# EAGLE schematic amplifier-controller (EAGLE 7.6.0)
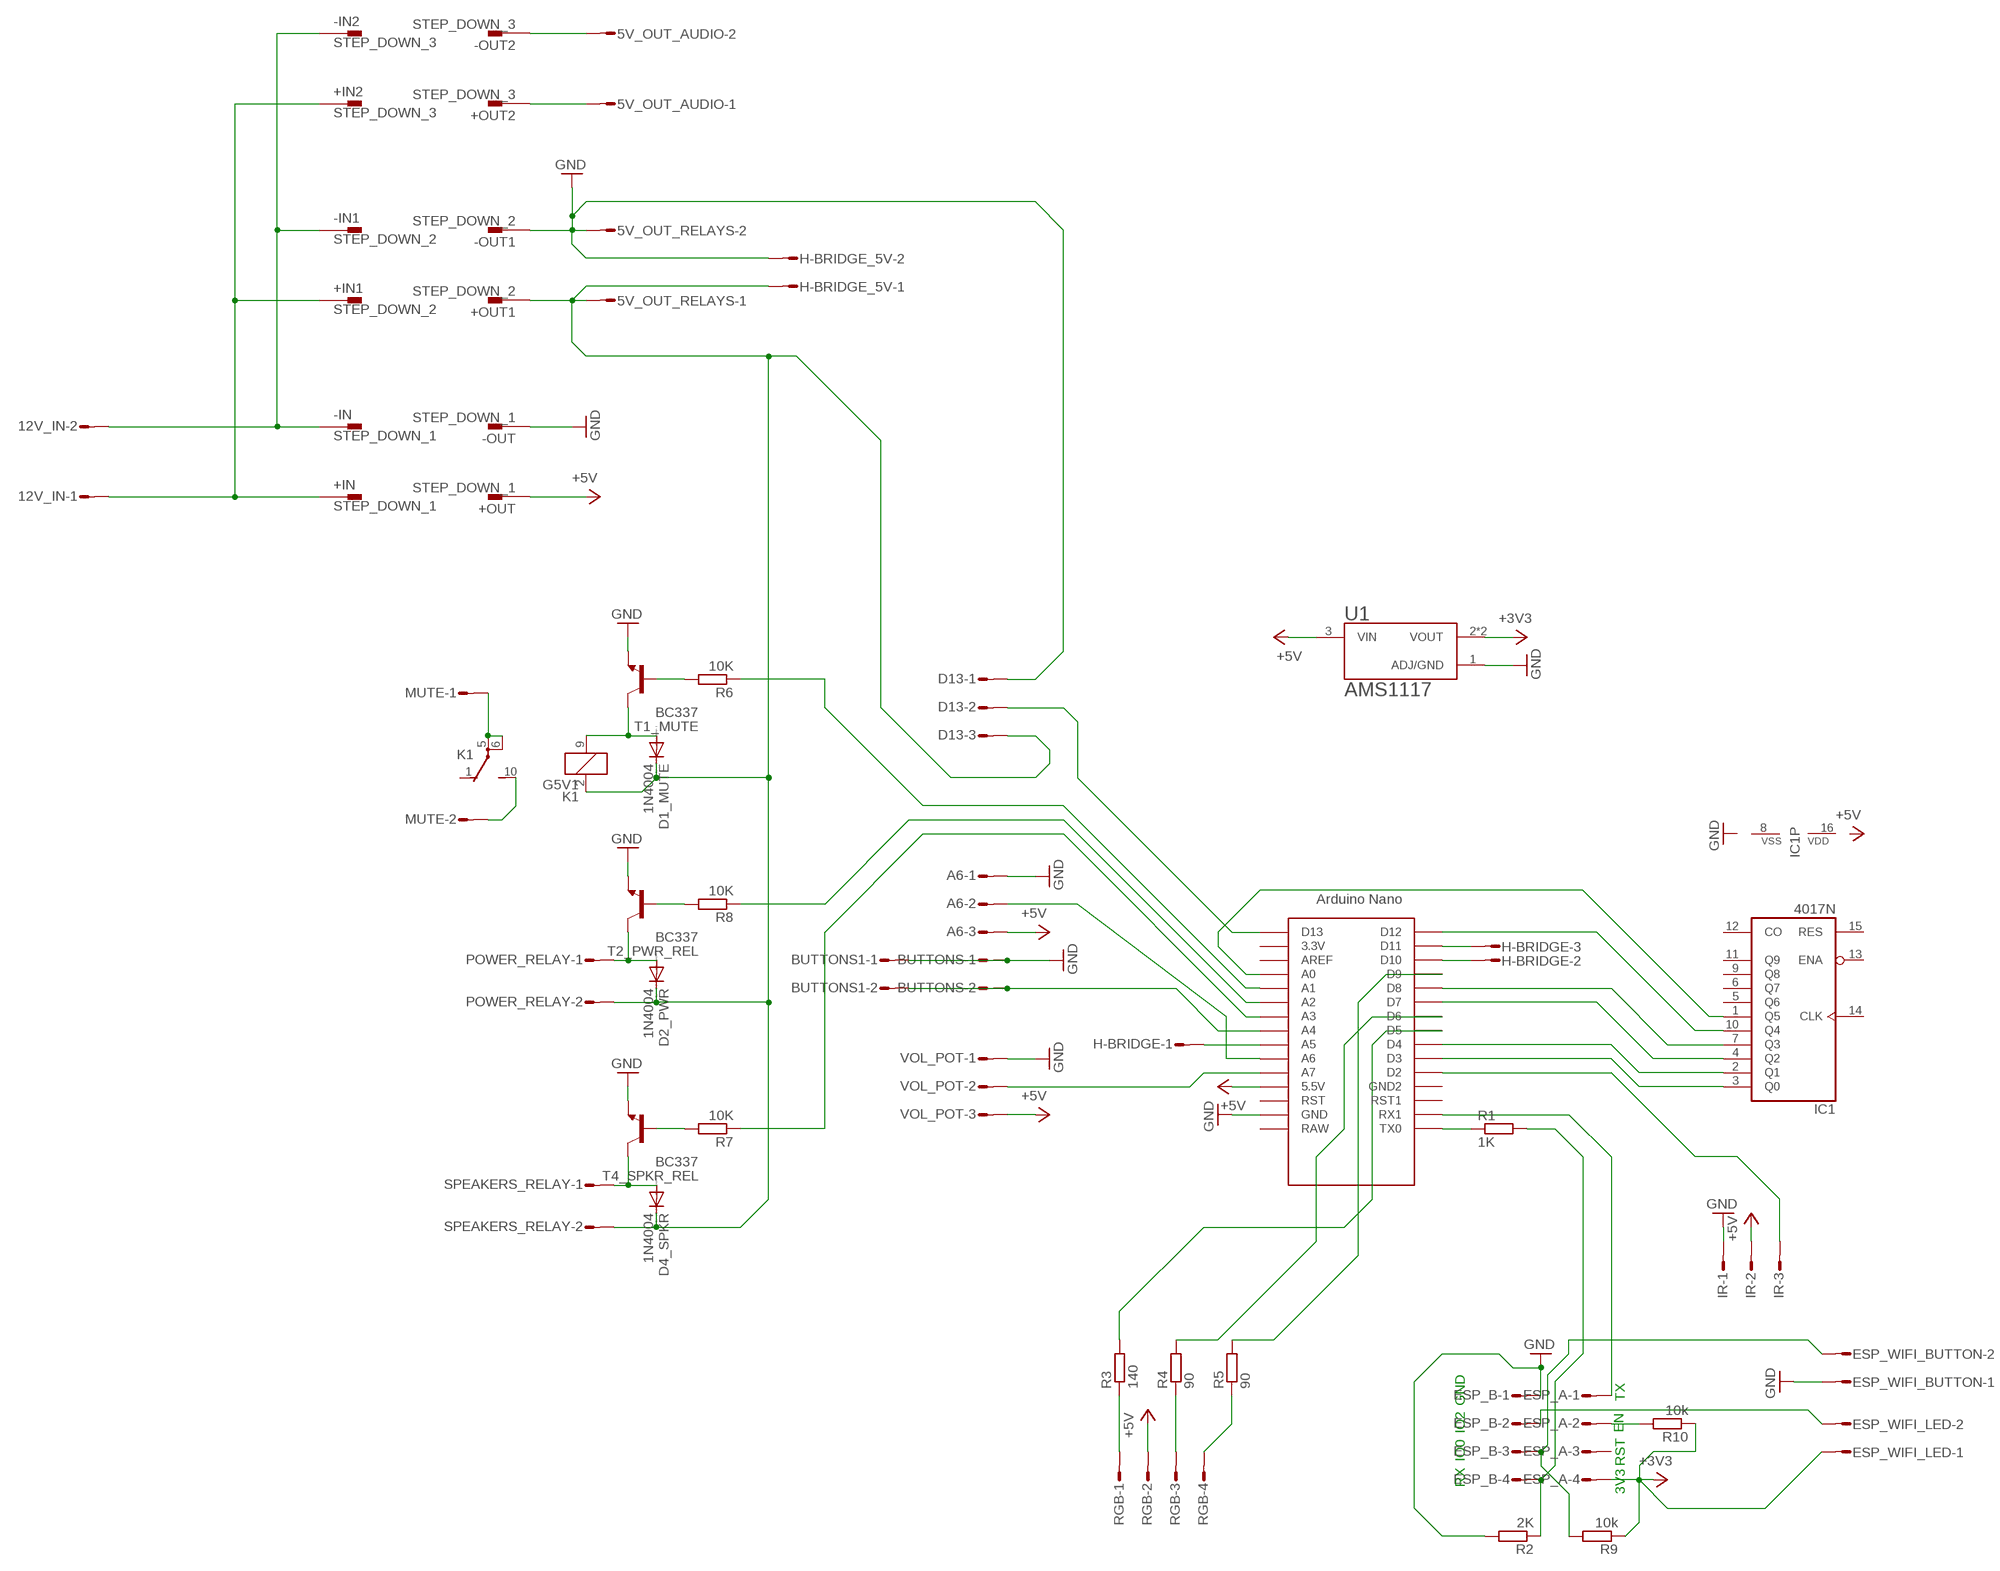
[diagram p0: schematic, sheet 1]

## Parts
5V_OUT_AUDIO  L02P  [L02P]
5V_OUT_RELAYS  L02P  [L02P]
12V_IN  L02P  [L02P]
+IN  STEP_DOWN_1  PIN1-2  [62221]
+IN1  STEP_DOWN_2  PIN1-2  [62221]
+IN2  STEP_DOWN_3  PIN1-2  [62221]
+OUT  STEP_DOWN_1  PIN1-2  [62221]
+OUT1  STEP_DOWN_2  PIN1-2  [62221]
+OUT2  STEP_DOWN_3  PIN1-2  [62221]
-IN  STEP_DOWN_1  PIN1-2  [62221]
-IN1  STEP_DOWN_2  PIN1-2  [62221]
-IN2  STEP_DOWN_3  PIN1-2  [62221]
-OUT  STEP_DOWN_1  PIN1-2  [62221]
-OUT1  STEP_DOWN_2  PIN1-2  [62221]
-OUT2  STEP_DOWN_3  PIN1-2  [62221]
A6  L03P  [L03P]
BUTTONS  L02P  [L02P]
BUTTONS1  L02P  [L02P]
D1_MUTE  1N4004  [DO41-10]
D2_PWR  1N4004  [DO41-10]
D4_SPKR  1N4004  [DO41-10]
D13  L03P  [L03P]
ESP_A  L04P  [L04P]
ESP_B  L04P  [L04P]
ESP_WIFI_BUTTON  L02P  [L02P]
ESP_WIFI_LED  L02P  [L02P]
H-BRIDGE  L03P  [L03P]
H-BRIDGE_5V  L02P  [L02P]
IC1  4017N  [DIL16]
IR  L03P  [L03P]
K1  G5V1  [G5V1]
MUTE  L02P  [L02P]
POWER_RELAY  L02P  [L02P]
R1  1K  R-EU_0411/15  [0411/15]
R2  2K  R-EU_0411/15  [0411/15]
R3  140  R-EU_0411/15  [0411/15]
R4  90  R-EU_0411/15  [0411/15]
R5  90  R-EU_0411/15  [0411/15]
R6  10K  R-EU_0309/12  [0309/12]
R7  10K  R-EU_0617/22  [0617/22]
R8  10K  R-EU_0309/12  [0309/12]
R9  10k  R-EU_0411/15  [0411/15]
R10  10k  R-EU_0411/15  [0411/15]
RGB  L04P  [L04P]
SPEAKERS_RELAY  L02P  [L02P]
T1_MUTE  BC337  [TO92]
T2_PWR_REL  BC337  [TO92]
T4_SPKR_REL  BC337  [TO92]
U1  AMS1117  [SOT229P700X180-4N]
U$1  NANO  [NANO]
VOL_POT  L03P  [L03P]

## Nets
+3V3: ESP_A.4 ESP_WIFI_LED.1 R9.1 R10.1 U1.2(VOUT) U1.4(VOUT)
+5V: +OUT.1 A6.3 IR.2 RGB.2 U1.3(VIN) U$1.5V(5.5V) VOL_POT.3
GND: 5V_OUT_RELAYS.2 -OUT1.1 -OUT.1 A6.1 BUTTONS1.1 BUTTONS.1 D13.1 ESP_B.1 ESP_WIFI_BUTTON.1 H-BRIDGE_5V.2 IR.1 R2.2 T1_MUTE.1(E) T2_PWR_REL.1(E) T4_SPKR_REL.1(E) U1.1(ADJ/GND) U$1.GND VOL_POT.1
N$1: ESP_B.4 R1.2 R2.1
N$2: R1.1 U$1.TX0
N$3: IR.3 U$1.D2
N$4: IC1.3(Q0) U$1.D3
N$5: IC1.2(Q1) U$1.D4
N$6: IC1.4(Q2) U$1.D7
N$7: IC1.7(Q3) U$1.D8
N$8: IC1.10(Q4) U$1.D12
N$9: IC1.1(Q5) U$1.A0
N$10: H-BRIDGE.1 U$1.A5
N$11: H-BRIDGE.2 U$1.D10
N$12: H-BRIDGE.3 U$1.D11
N$13: U$1.A7 VOL_POT.2
N$14: BUTTONS1.2 BUTTONS.2 U$1.A4
N$15: R3.1 RGB.1
N$16: R4.1 RGB.3
N$17: R5.1 RGB.4
N$18: R3.2 U$1.D5
N$19: R4.2 U$1.D6
N$20: R5.2 U$1.D9
N$21: D13.2 U$1.D13
N$22: A6.2 U$1.A6
N$23: ESP_B.3 ESP_WIFI_BUTTON.2 R9.2
N$24: ESP_A.1 U$1.RX1
N$25: D4_SPKR.A SPEAKERS_RELAY.1 T4_SPKR_REL.3(C)
N$26: R7.2 T4_SPKR_REL.2(B)
N$27: R6.2 T1_MUTE.2(B)
N$28: R6.1 U$1.A1
N$29: R7.1 U$1.A3
N$30: D1_MUTE.A K1.9 T1_MUTE.3(C)
N$31: R8.2 T2_PWR_REL.2(B)
N$32: R8.1 U$1.A2
N$33: D2_PWR.A POWER_RELAY.1 T2_PWR_REL.3(C)
N$34: ESP_A.2 R10.2
N$35: 12V_IN.2 -IN1.1 -IN2.1 -IN.1
N$36: ESP_B.2 ESP_WIFI_LED.2
N$37: 12V_IN.1 +IN1.1 +IN2.1 +IN.1
N$38: K1.5(2:P) K1.6(2:P) MUTE.1
N$39: K1.10(2:S) MUTE.2
N$40: 5V_OUT_AUDIO.1 +OUT2.1
N$41: 5V_OUT_AUDIO.2 -OUT2.1
N$43: 5V_OUT_RELAYS.1 +OUT1.1 D1_MUTE.C D2_PWR.C D4_SPKR.C D13.3 H-BRIDGE_5V.1 K1.2 POWER_RELAY.2 SPEAKERS_RELAY.2
Unconnected: ESP_A.3 IC1.5(Q6) IC1.6(Q7) IC1.9(Q8) IC1.11(Q9) IC1.12(CO) IC1.13(ENA) IC1.14(CLK) IC1.15(RES) K1.1(2:O) U$1.3.3V U$1.AREF U$1.GND1(GND2) U$1.RAW U$1.RST U$1.RST1

## Notes on the sheet
- TX
- GND
- IO2 | EN
- IO0
- RST
- RX
- 3V3

## Power pins joined to a net without a drawn wire
VDD: IC1.16(VDD)
VSS: IC1.8(VSS)

## Library data of the parts
5V_OUT_AUDIO 5V_OUT_RELAYS 12V_IN BUTTONS BUTTONS1 ESP_WIFI_BUTTON ESP_WIFI_LED H-BRIDGE_5V MUTE POWER_RELAY SPEAKERS_RELAY = con-amp-mt:L02P: AMP MT CONNECTOR; OC_FARNELL: unknown; OC_NEWARK: unknown
+IN +IN1 +IN2 +OUT +OUT1 +OUT2 -IN -IN1 -IN2 -OUT -OUT1 -OUT2 = con-faston:PIN1-2: CONN TAB FASTON BRASS .187 PCB TAB, FSSTON, DUAL STAKE, .187 SERIES Digi-Key Part Number: A24734CT-ND Source: Tyco Electronics Corporation .. ENG_CD_62221_R.pdf http://search.digikey.com/scripts/DkSearch/dksus.dll?Detail&name=A24734CT-ND; MF: TYCO ELECTRONICS; MPN: 62221-1; OC_FARNELL: unknown; OC_NEWARK: 16H2318
A6 D13 H-BRIDGE IR VOL_POT = con-amp-mt:L03P: AMP MT CONNECTOR; OC_FARNELL: unknown; OC_NEWARK: unknown
D1_MUTE D2_PWR D4_SPKR = diode:1N4004: DIODE general purpose rectifier, 1 A
ESP_A ESP_B RGB = con-amp-mt:L04P: AMP MT CONNECTOR; OC_FARNELL: unknown; OC_NEWARK: unknown
IC1 = 40xx:4017: COUNTER/DIVIDER
K1 = relay:G5V1: RELAY 1 x switch, 0.5 A/125 V AC, 1 A/24 V DC , Omron; MPN: G5V-1-DC24; OC_FARNELL: 9949593; OC_NEWARK: 36M6377
R1-R6 R8-R10 = resistor:R-EU_: RESISTOR, European symbol
R7 = rcl:R-EU_: RESISTOR, European symbol
T1_MUTE T2_PWR_REL T4_SPKR_REL = transistor:BC337: NPN TRANSISTOR
U1 = AMS1117:AMS1117: Sot223/Pkg 1-Amp 5-Volt Low Drop Out Voltage Regulatator; AVAILABILITY: Unavailable; DESCRIPTION: 1A LOW DROPOUT VOLTAGE REGULATOR SOT-223; MF: Advanced Monolithic Systems; MP: AMS1117; PACKAGE: SOT-223 Seeed Technology; PRICE: None
U$1 = Arduino-clone_NO_ISA:NANO: Arduino Nano